# EAGLE schematic moisture_sensors (EAGLE 6.4)
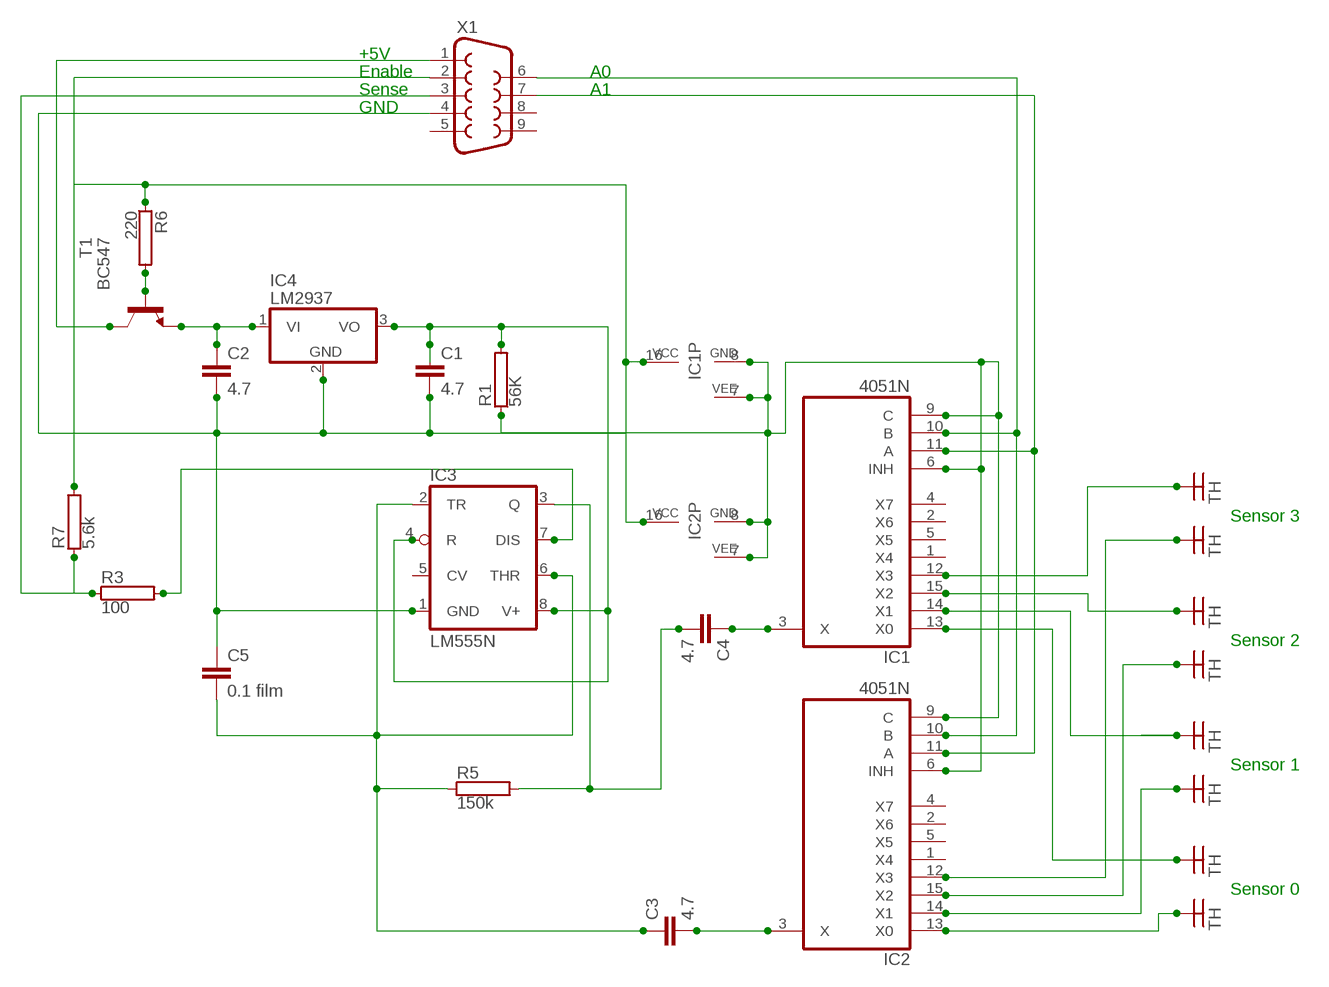
[diagram p0: schematic, sheet 1]

## Parts
C1  4.7  C2,5-3  [C2.5-3]
C2  4.7  C2,5-3  [C2.5-3]
C3  4.7  C2,5-3  [C2.5-3]
C4  4.7  C2,5-3  [C2.5-3]
C5  0.1 film  C2,5-3  [C2.5-3]
IC1  4051N  [DIL16]
IC2  4051N  [DIL16]
IC3  LM555N  [DIL08]
IC4  LM2937  [TO263-3]
R1  56K  RAC01  [AC01]
R3  100  RAC01  [AC01]
R5  150k  RAC01  [AC01]
R6  220  RAC01  [AC01]
R7  5.6k  RAC01  [AC01]
T1  BC547  [TO92]
X1  DB9MALE  [DB9_MALE]

## Nets
N$1: IC3.7(DIS) R3.2
N$2: C2.1 IC4.1(VI) T1.1(E)
N$3: C1.1 IC3.4(R) IC3.8(V+) IC4.3(VO) R1.2
N$4: R6.2 T1.2(B)
N$5: IC1.10(B) IC2.10(B) X1.6
N$6: C3.1 C5.2 IC3.2(TR) IC3.6(THR) R5.1
N$7: IC1.11(A) IC2.11(A) X1.7
N$8: C4.2 IC3.3(Q) R5.2
N$9: C4.1 IC1.3(X)
N$10: T1.3(C) X1.1
N$11: C3.2 IC2.3(X)
N$12: C1.2 C2.2 C5.1 IC1.6(INH) IC1.7(VEE) IC1.8(GND) IC1.9(C) IC1.16(VCC) IC2.6(INH) IC2.7(VEE) IC2.8(GND) IC2.9(C) IC2.16(VCC) IC3.1(GND) IC4.2(GND) R1.1 R6.1 R7.2 X1.2 X1.4
N$13: R3.1 R7.1 X1.3
TH: IC1.12(X3) IC1.13(X0) IC1.14(X1) IC1.15(X2) IC2.12(X3) IC2.13(X0) IC2.14(X1) IC2.15(X2)
Unconnected: IC1.1(X4) IC1.2(X6) IC1.4(X7) IC1.5(X5) IC2.1(X4) IC2.2(X6) IC2.4(X7) IC2.5(X5) IC3.5(CV) X1.5 X1.8 X1.9

## Notes on the sheet
- +5V
- Enable | A0
- Sense | A1
- GND
- Sensor 3
- Sensor 2
- Sensor 1
- Sensor 0

## Library data of the parts
C1-C5 = capacitor-wima:C: CAPACITOR naming: grid - package width
IC1 IC2 = 40xx:4051: 8-channel ANALOG MULTIPLEXER
IC3 = linear:*555: TIMER
IC4 = linear:LM2937: LM2937-2.5, LM2937-3.3 400mA and 500mA Voltage Regulators Source: http://cache.national.com/ds/LM/LM2937-2.5.pdf
R1 R3 R5-R7 = resistor-power:R: Power Resitor; OC_FARNELL: unknown; OC_NEWARK: unknown
T1 = transistor:BC547: NPN TRANSISTOR
X1 = SparkFun-Connectors:DB9: DB9 Connector Standard DB9 (D-Sub 9) serial connector. Can be used for CAN bus as well as RS485 and RS232. Footprint production proven. Spark Fun Electronics SKU : PRT-00429